# Altium schematic sheet Power_test.SchDoc
size A4
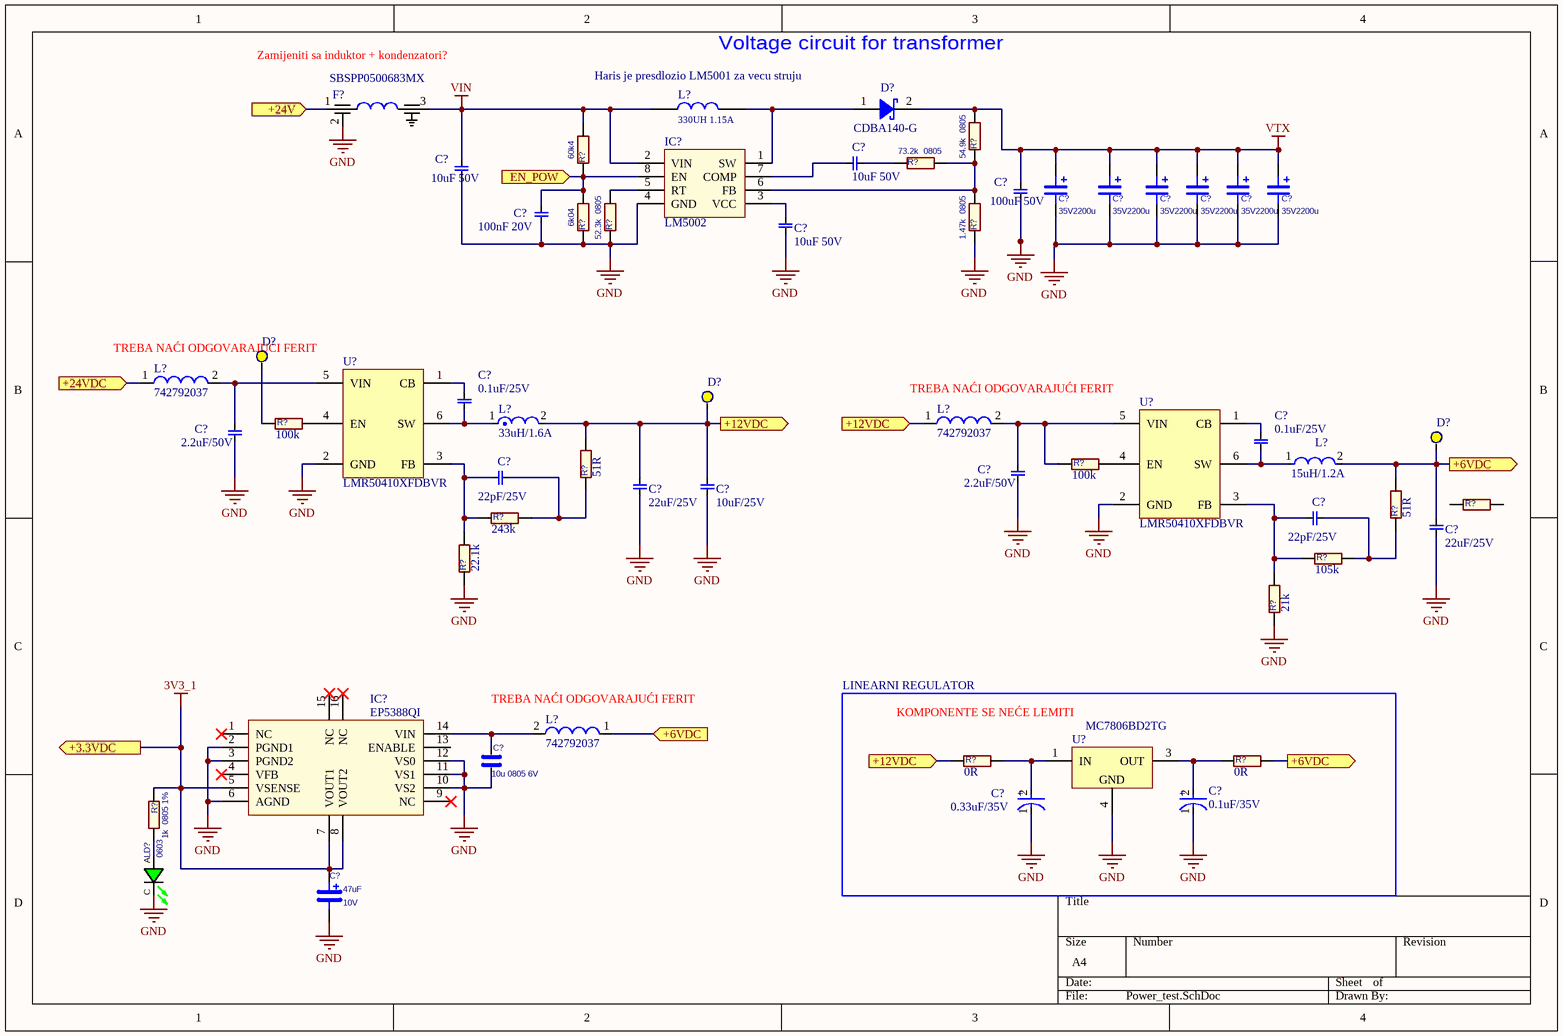
[diagram p0: Power_test.SchDoc]

## Parts
(Parts that share a designator on the sheet are numbered #1, #2 ... from top to bottom, then left to right.)
C?#1  10uF 50V  [C-0603]
C?#2  10uF 50V  [C-0805]
C?#3  35V2200u  [CAP_16X25]
C?#4  35V2200u  [CAP_16X25]
C?#5  35V2200u  [CAP_16X25]
C?#6  35V2200u  [CAP_16X25]
C?#7  35V2200u  [CAP_16X25]
C?#8  35V2200u  [CAP_16X25]
C?#9  100uF 50V  [C-0805]
C?#10  100nF 20V  [C-0603]
C?#11  10uF 50V  [C-0603]
C?#12  0.1uF/25V  [C-0603]
C?#13  2.2uF/50V  [FP-CL31-IPC_B]
C?#14  0.1uF/25V  [C-0603]
C?#15  2.2uF/50V  [FP-CL31-IPC_B]
C?#16  22pF/25V  [C-0603]
C?#17  10uF/25V  [C-1206 (3216 metric)]
C?#18  22uF/25V  [CAP-1210]
C?#19  22pF/25V  [C-0603]
C?#20  22uF/25V  [CAP-1210]
C?#21  10u 0805 6V  [CAP-0805]
C?#22  0.33uF/35V  [FP-UUP1H0R1MCL1GS-MFG]
C?#23  0.1uF/35V  [FP-UUP1H0R1MCL1GS-MFG]
C?#24  Capacitance: 47uF  Voltage Rating: 10V  [ECS_6.3]  (hidden comment: CAP 47uF 10V Radial Elec)
D?#1  Manufacturer Part Number 1: CDBA140-G  [DFN380P520X45-2N]  (hidden comment: DIODE SCHOTTKY 40V 1A DO214AC)
D?#2  Test_Point  [Test_Point]  (value not drawn)
D?#3  Test_Point  [Test_Point]  (value not drawn)
D?#4  Test_Point  [Test_Point]  (value not drawn)
F?  SBSPP0500683MX  [Filter_SBSPP0500]
IC?#1  LM5002  [SOIC127P600X205-8N]
IC?#2  EP5388QI  [PQFN50P320X320X100_HS-17N]
L?#1  330UH 1.15A  [IND]
L?#2  742792037  [SMD-0805]
L?#3  742792037  [SMD-0805]
L?#4  33uH/1.6A  [FP-DS104C2-MFG]
L?#5  15uH/1.2A  [FP-LQH5BPB_T0-MFG]
L?#6  742792037  [SMD-0805]
LD?  0603  [LED 0603 Green]
R?#1  73.2k  0805  [R-0603]
R?#2  54.9k  0805  [R-0603]
R?#3  60k4  [R-0603]
R?#4  6k04  [R-0603]
R?#5  52.3k  0805  [R-0603]
R?#6  1.47k  0805  [R-0603]
R?#7  100k  [R-0603]
R?#8  100k  [R-0603]
R?#9  51R  [R-0603]
R?#10  0R  [RES-0805]  (value not drawn)
R?#11  243k  [R-0603]
R?#12  51R  [R-0603]
R?#13  105k  [R-0603]
R?#14  22.1k  [R-0603]
R?#15  21k  [R-0603]
R?#16  0R  [RES-0805]
R?#17  0R  [RES-0805]
R?#18  1k  0805 1%  [RES-0805]
U?#1  LMR50410XFDBVR  [SOT-23]
U?#2  LMR50410XFDBVR  [SOT-23]
U?#3  MC7806BD2TG  [D2PAK]

## Ports
+3.3VDC (out), +6VDC (in), +6VDC (out), +12VDC (in), +12VDC (out), +24V (in), +24VDC (in), EN_POW (in)

## Nets
3V3_1: C?#24.1 IC?#2.5(VSENSE) IC?#2.7(VOUT1) IC?#2.8(VOUT2) R?#18.1 ; port +3.3VDC
GND: C?#2.2(G) C?#3.2 C?#4.2 C?#5.2 C?#6.2 C?#7.2 C?#8.2 C?#9.2(G) C?#10.1(G) C?#11.2(G) C?#13.1(G) C?#15.1(G) C?#17.2(G) C?#18.1(G) C?#20.1(G) C?#21.2 C?#22.1(C) C?#23.1(C) C?#24.2 F?.2 IC?#1.4(GND) IC?#2.2(PGND1) IC?#2.3(PGND2) IC?#2.6(AGND) IC?#2.10(VS2) IC?#2.11(VS1) IC?#2.12(VS0) LD?.C(CATHODE) R?#4.1 R?#5.1 R?#6.1 R?#14.1 R?#15.1 U?#1.2(GND) U?#2.2(GND) U?#3.4(GND)
VIN: C?#2.1(G) F?.3 IC?#1.2(VIN) L?#1.1(A) R?#3.2
VTX: C?#3.1 C?#4.1 C?#5.1 C?#6.1 C?#7.1 C?#8.1 C?#9.1(G) D?#1.2(A) R?#2.2
+6VDC: C?#20.2(G) D?#4.1 L?#5.2 L?#6.1 R?#12.2 R?#17.2 ; port +6VDC
+12VDC: C?#17.1(G) C?#18.2(G) D?#3.1 L?#3.1 L?#4.2 R?#9.2 R?#16.1 ; port +12VDC
+24V: F?.1 ; port +24V
+24VDC: L?#2.1 ; port +24VDC
EN_POW: C?#10.2(G) IC?#1.8(EN) R?#3.1 R?#4.2 ; port EN_POW
NetC?#1_1: C?#1.1(G) IC?#1.7(COMP)
NetC?#1_2: C?#1.2(G) R?#1.1
NetC?#11_1: C?#11.1(G) IC?#1.3(VCC)
NetC?#12_1: C?#12.1(G) L?#4.1 U?#1.6(SW)
NetC?#12_2: C?#12.2(G) U?#1.1(CB)
NetC?#13_2: C?#13.2(G) L?#2.2 U?#1.5(VIN)
NetC?#14_1: C?#14.1(G) L?#5.1 U?#2.6(SW)
NetC?#14_2: C?#14.2(G) U?#2.1(CB)
NetC?#15_2: C?#15.2(G) L?#3.2 R?#8.1 U?#2.5(VIN)
NetC?#16_1: C?#16.1(G) R?#11.1 R?#14.2 U?#1.3(FB)
NetC?#16_2: C?#16.2(G) R?#9.1 R?#11.2
NetC?#19_1: C?#19.1(G) R?#13.1 R?#15.2 U?#2.3(FB)
NetC?#19_2: C?#19.2(G) R?#12.1 R?#13.2
NetC?#21_1: C?#21.1 IC?#2.14(VIN) L?#6.2
NetC?#22_2: C?#22.2(A) R?#16.2 U?#3.1(IN)
NetC?#23_2: C?#23.2(A) R?#17.1 U?#3.3(OUT)
NetD?#1_1: D?#1.1(A) IC?#1.1(SW) L?#1.2(A)
NetD?#2_1: D?#2.1 R?#7.1
NetIC?#1_5: IC?#1.5(RT) R?#5.2
NetIC?#1_6: IC?#1.6(FB) R?#1.2 R?#2.1 R?#6.2
NetLD?_A: LD?.A(ANODE) R?#18.2
NetR?#7_2: R?#7.2 U?#1.4(EN)
NetR?#8_2: R?#8.2 U?#2.4(EN)

Not connected (* = marked no-connect by the designer): IC?#2 1(NC)* 4(VFB)* 9(NC)* 13(ENABLE) 15(NC)* 16(NC)*; R?#10 1 2

## Notes on the sheet
- (near F?) Zamijeniti sa induktor + kondenzatori?
- (near L?#1) Haris je presdlozio LM5001 za vecu struju
- Voltage circuit for transformer
- (near D?#2) TREBA NAĆI ODGOVARAJUĆI FERIT
- (near L?#3) TREBA NAĆI ODGOVARAJUĆI FERIT
- (near L?#6) TREBA NAĆI ODGOVARAJUĆI FERIT
- LINEARNI REGULATOR
- KOMPONENTE SE NEĆE LEMITI
- (in symbol UUP1H0R1MCL1GS) +
- (in symbol UZS1HR33MCL1GB) +

## Library data of the parts
C?#1 C?#2 C?#9 C?#11 = C-0805_10uF: Manufacturer 1: Yageo; Manufacturer Part Number 1: CC1206KKX7RBBB332; Tolerance: ±10%; Voltage - Rated: 500V; Temperature Coefficient: X7R; Notification: Current market demand for these product types have resulted in fluctuating and extending lead times. Lead times may differ.; Description 1: CAP CER 3300PF 500V X7R 1206; Category 1: Capacitors; Packaging: Cut Tape (CT); Part Status: Active; Operating Temperature: -55°C ~ 125°C; Features: -; Ratings: -; Applications: General Purpose; Failure Rate: -; Mounting Type: Surface Mount, MLCC; Package / Case: 1206 (3216 Metric); Size / Dimension: 0.126" L x 0.063" W (3.20mm x 1.60mm); Height - Seated (Max): -; Thickness (Max): 0.057" (1.45mm); Lead Spacing: -; Lead Style: -; ComponentLink1URL: http://www.yageo.com/documents/recent/UPY-NP0X7R_MV_100-to-630V_21.pdf; ComponentLink1Description: http://www.yageo.com/documents/recent/UPY-NP0X7R_MV_100-to-630V_21.pdf; Supplier 1: Digi-Key; Supplier Part Number 1: 311-1506-1-ND; RoHS 1: RoHS Compliant; Stock 1: 4928; Pricing 1: 1=0.31, 10=0.214, 100=0.1085, 500=0.07424, 1000=0.06568 (USD)
C?#3-C?#8 = CAP_2200uF_35V: Capacitor; Manufacturer: Kemet; Manufacturer Part Number: ESH228M035AM7AA; Capacitance: 2200µF; Tolerance: ±20%; Voltage Rating: 35V; Lifetime @ Temp.: 2000 Hrs @ 105°C; Supplier 1: Digi-Key; Supplier Part Number 1: 399-6572-ND; RoHS: RoHS Compliant; Category: Capacitors; Stock 1: 1972; Pricing 1: 1=0.98, 10=0.77, 50=0.6676, 100=0.5778, 250=0.5136, 500=0.43656, 1000=0.3852, 2500=0.35952, 5000=0.34668 (USD); Packaging: Bulk; ESR (Equivalent Series Resistance): -; Operating Temperature: -40°C ~ 105°C; Type: -; Applications: General Purpose; Ripple Current: -; Impedance: -; Lead Spacing: 0.295" (7.50mm); Size / Dimension: 0.630" Dia (16.00mm); Height - Seated (Max): 1.063" (27.00mm); Surface Mount Land Size: -; Mounting Type: Through Hole; Package / Case: Radial, Can; ComponentLink1URL: http://www.kemet.com/docfinder?Partnumber=ESH228M035AM7AA; ComponentLink1Description: http://www.kemet.com/docfinder?Partnumber=ESH228M035AM7AA
C?#10 = C-0805_100nF: Manufacturer 1: Yageo; Manufacturer Part Number 1: CC1206KKX7RBBB332; Tolerance: ±10%; Voltage - Rated: 500V; Temperature Coefficient: X7R; Notification: Current market demand for these product types have resulted in fluctuating and extending lead times. Lead times may differ.; Description 1: CAP CER 3300PF 500V X7R 1206; Category 1: Capacitors; Packaging: Cut Tape (CT); Part Status: Active; Operating Temperature: -55°C ~ 125°C; Features: -; Ratings: -; Applications: General Purpose; Failure Rate: -; Mounting Type: Surface Mount, MLCC; Package / Case: 1206 (3216 Metric); Size / Dimension: 0.126" L x 0.063" W (3.20mm x 1.60mm); Height - Seated (Max): -; Thickness (Max): 0.057" (1.45mm); Lead Spacing: -; Lead Style: -; ComponentLink1URL: http://www.yageo.com/documents/recent/UPY-NP0X7R_MV_100-to-630V_21.pdf; ComponentLink1Description: http://www.yageo.com/documents/recent/UPY-NP0X7R_MV_100-to-630V_21.pdf; Supplier 1: Digi-Key; Supplier Part Number 1: 311-1506-1-ND; RoHS 1: RoHS Compliant; Stock 1: 4928; Pricing 1: 1=0.31, 10=0.214, 100=0.1085, 500=0.07424, 1000=0.06568 (USD)
C?#12 C?#14 = 06033C104JAZ2A: 0.1µF ±5% 25V Ceramic Capacitor X7R 0603 (1608 Metric); Manufacturer: Kyocera AVX; Capacitance: 100nF; ComponentLink1URL: http://catalogs.avx.com/SurfaceMount.pdf?src-supplier=Digi-Key; ComponentLink1Description: http://catalogs.avx.com/SurfaceMount.pdf?src-supplier=Digi-Key; Case/Package: 0603; Category: Ceramic Capacitors; Dielectric: X7R; Features: Soft Termination; Length: 0.063inch; Manufacturer Part Number: 06033C104JAZ2A; Max Operating Temperature: 125°C; Min Operating Temperature: -55°C; Mount: Surface Mount; Package Quantity: 4000; Packaging: Tape and Reel; RoHS Compliant: Yes; Thickness: 0.035inch; Tolerance: 5%; Voltage Rating: 25V; Voltage Rating (DC): 25V; Width: 0.031inch
C?#13 C?#15 = CL31B225KBHVPNE: Cap Ceramic 2.2uF 50V X7R ±10% SMD 1206 +125°C Embossed T/R; Width: 0.063inch; Case/Package: 1206; Tolerance: 10%; Mount: Surface Mount; Capacitance: 2.2uF; Ratings: AEC-Q200; Thickness: 0.071inch; Voltage Rating: 50V; Features: Soft Termination; Case Code (Metric): 3216; Length: 0.126inch; Packaging: Tape and Reel; Max Operating Temperature: 125°C; Min Operating Temperature: -55°C; Case Code (Imperial): 1206; Dielectric: X7R
C?#16 C?#19 = C0603C220K3GACTU: 22pF ±10% 25V Ceramic Capacitor C0G, NP0 0603 (1608 Metric); Manufacturer: KEMET; Dissipation Factor: 0.1%; Width: 0.031inch; Capacitance: 22pF; Case Code (Imperial): 0603; Case Code (Metric): 1608; Case/Package: 0603; Category: Ceramic Capacitors; Construction: Flat; Contact Plating: Tin,Matte; Depth: 0.8mm; Dielectric: C0G; Dielectric Material: Ceramic; Height: 0.8mm; Lead Free: Lead Free; Lead Pitch: 0.7mm; Length: 1.6mm; Manufacturer Part Number: C0603C220K3GACTU; Max Operating Temperature: 125°C; Min Operating Temperature: -55°C; Mount: Surface Mount; Package Quantity: 4000; Packaging: Tape and Reel; Radiation Hardening: No; RoHS Compliant: Yes; Series: C; Termination: SMD/SMT; Thickness: 0.034inch; Tolerance: 10%; Voltage Rating: 25V; Voltage Rating (DC): 25V; ComponentLink1URL: https://datasheet.ciiva.com/5413/kem-c1003-c0g-smd-356956-5413159.pdf?src-supplier=Mouser; ComponentLink1Description: https://datasheet.ciiva.com/5413/kem-c1003-c0g-smd-356956-5413159.pdf?src-supplier=Mouser
C?#17 = CL31B106KAHNNNE: 10µF ±10% 25V Ceramic Capacitor X7R 1206 (3216 Metric); Manufacturer: Samsung; Capacitance: 10uF; Case Code (Imperial): 1206; Case Code (Metric): 3216; Case/Package: 1206; Category: Ceramic Capacitors; Construction: Flat; Depth: 1.6mm; Dielectric: X7R; Height: 1.6mm; Length: 3.2mm; Manufacturer Part Number: CL31B106KAHNNNE; Max Operating Temperature: 125°C; Min Operating Temperature: -55°C; Mount: Surface Mount; Package Quantity: 1; Packaging: Tape and Reel; Radiation Hardening: No; RoHS Compliant: Yes; Series: CL; Thickness: 0.071inch; Tolerance: 10%; Voltage: 25V; Voltage Rating: 25V; Width: 0.063inch; ComponentLink1URL: https://datasheet.ciiva.com/25795/cl31b106kahnnne-25795260.pdf?src-supplier=Digi-Key; ComponentLink1Description: https://datasheet.ciiva.com/25795/cl31b106kahnnne-25795260.pdf?src-supplier=Digi-Key
C?#18 C?#20 = CL32B226KAJNNNE: 22µF ±10% 25V Ceramic Capacitor X7R 1210 (3225 Metric); Manufacturer: Samsung; Capacitance: 22uF; Case Code (Imperial): 1210; Case Code (Metric): 3225; Case/Package: 1210; Category: Ceramic Capacitors; Construction: Flat; Depth: 2.5mm; Dielectric: X7R; Height: 2.5mm; Lead Free: Lead Free; Length: 3.2mm; Manufacturer Part Number: CL32B226KAJNNNE; Material: Ceramic; Max Operating Temperature: 125°C; Min Operating Temperature: -55°C; Mount: Surface Mount; Package Quantity: 1; Packaging: Tape and Reel; Radiation Hardening: No; RoHS Compliant: Yes; Series: CL; Thickness: 0.106inch; Tolerance: 10%; Voltage Rating: 25V; Voltage Rating (DC): 25V; Width: 0.098inch
C?#21 = 08056C106KAT2A: CAP CER 10UF 6.3V 10% X7R 0805; Manufacturer 1: AVX Corporation; Category 1: Capacitors; Tolerance: ?0%; Description 2: Multilayer Ceramic Capacitors MLCC - SMD/SMT 6.3volts 10uF 10% X7R; Category 2: Multilayer Ceramic Capacitors MLCC - SMD/SMT; Description 3: Cap Ceramic 10uF 6.3V X7R 10% SMD 0805 125C Embossed T/R; Lead Time: 16 weeks; Peak Solder Temperature: 260 deg C; MSL (Moisture Sensitivity Level): 1; Description 4: Capacitor; Ceramic; Cap 10uF Tol 10%; SMT; Vol-Rtg 6.3V; X7R; TR; Material, Element: Ceramic; Voltage, Rating: 6.3; Supplier 1: Digi-Key; Supplier Part Number 1: 478-5322-2-ND; Manufacturer Part Number 1: 08056C106KAT2A; RoHS 1: RoHS Compliant; Description 1: CAP CER 10UF 6.3V 10% X7R 0805; Temperature Coefficient: X7R; Mounting Type: Surface Mount, MLCC; Operating Temperature: -55°C ~ 125°C; Applications: General Purpose; Ratings: -; Package / Case: 0805 (2012 Metric); Size / Dimension: 0.079" L x 0.049" W (2.01mm x 1.25mm); Height - Seated (Max): -; Thickness (Max): 0.055" (1.40mm); Lead Spacing: -; Features: -; Packaging: Tape & Reel (TR); Lead Style: -; ComponentLink1URL: http://www.avx.com/docs/Catalogs/cx7r.pdf; ComponentLink1Description: http://www.avx.com/docs/Catalogs/cx7r.pdf; Supplier 2: Mouser; Supplier Part Number 2: 581-08056C106KAT2A; Manufacturer 2: AVX; Manufacturer Part Number 2: 08056C106KAT2A; RoHS 2: RoHS Compliant By Exemption; Dimensions: 1.25 mm W x 2.01 mm L x 1.52 mm H; Operating Temperature Range: - 55 C to + 125 C; Product: General Type MLCCs; Termination Style: SMD/SMT; Voltage Rating: 6.3 V; Case Code - in: 0805; Case Code - mm: 2012; Product Category: 0805 SMD Ceramic Capacitors; Standard Pack Qty: 3000; Temperature Coefficient / Code: X7R; RoHS - Mouser: E; Minimum Order Quantity: 1; Reeling: True; ComponentLink2URL: http://avx.com/docs/Catalogs/cx7r.pdf; ComponentLink2Description: http://avx.com/docs/Catalogs/cx7r.pdf; Supplier 3: Arrow; Supplier Part Number 3: 43503547S9668841N7710; Manufacturer 3: AVX; Manufacturer Part Number 3: 08056C106KAT2A; RoHS 3: CHINA ROHS: Compliant / EU ROHS: Compliant; Package Quantity: 3000; Termination Finish: Matte Sn/Ni; China ROHS Lead (X -> above / O -> below threshold): O; China ROHS Mercury (X -> above / O -> below threshold): O; China ROHS Cadmium (X -> above / O -> below threshold): O; China ROHS Hex Chromium (X -> above / O -> below threshold): O; China ROHS PBB (X -> above / O -> below threshold): O; China ROHS PBDE (X -> above / O -> below threshold): O; EU_ROHS_PROD_EXEMPTION_BY_SUPP: N/R; ComponentLink3URL: http://components.arrow.com/partservice/dataview/altium/43503547S9668841N7710?apiKey=aa438727d59eed98c4bed826d8d949c84cb5e685b92bf87346a0226bd2658797; ComponentLink3Description: http://components.arrow.com/partservice/dataview/altium/43503547S9668841N7710?apiKey=aa438727d59eed98c4bed826d8d949c84cb5e685b92bf87346a0226bd2658797; Supplier 4: Allied; Supplier Part Number 4: 70001700; Manufacturer 4: AVX; Manufacturer Part Number 4: 08056C106KAT2A; RoHS 4: RoHS Compliant; Category 4: Capacitors; Case Size: 0805; Dielectric Characteristic: X7R; Termination: SMT; Order Multiple: 1; ComponentLink4URL: http://www.alliedelec.com//www.alliedelec.com/images/products/datasheets/bm/AVX/70001075.pdf; ComponentLink4Description: http://www.alliedelec.com//www.alliedelec.com/images/products/datasheets/bm/AVX/70001075.pdf
C?#22 = UZS1HR33MCL1GB: 0.33µF 50V Aluminum Electrolytic Capacitors Radial, Can - SMD  2000 Hrs @ 85°C; Manufacturer: Nichicon; Capacitance: 330nF; Leakage Current: 3uA; Life (Hours): 2000Hour; Ripple Current: 2.8mA; Tolerance: 20%; Voltage Rating (DC): 50V; Case/Package: Radial; Category: Aluminum Electrolytic Capacitors; Features: General Purpose; Height - Seated (Max): 0.157inch; Length: 4.5mm; Manufacturer Part Number: UZS1HR33MCL1GB; Max Operating Temperature: 85°C; Min Operating Temperature: -40°C; Mount: Surface Mount; Package Quantity: 2000; Packaging: Tape and Reel; RoHS Compliant: Yes; Series: ZS; Termination: SMD/SMT; Voltage Rating: 50V
C?#23 = UUP1H0R1MCL1GS: 0.1µF 50V Aluminum Electrolytic Capacitors Radial, Can - SMD  1000 Hrs @ 105°C; Life (Hours): 1000Hour; Leakage Current: 10uA; Ripple Current: 1mA; Tolerance: 20%; Dissipation Factor: 0.15%; Capacitance: 100nF; Radiation Hardening: No; Max Operating Temperature: 105°C; Voltage Rating: 50V; Package Quantity: 2000; Diameter: 4mm; Voltage Rating (DC): 50V; Mount: Surface Mount; Packaging: Tape and Reel; Termination: SMD/SMT; Min Operating Temperature: 1000°C; Length: 5.8mm; Height: 5.8mm; Case/Package: Radial; Height - Seated (Max): 0.157inch
C?#24 = 10SVP47M: SANYO - 10SVP47M - CAPACITOR, 47UF, 10V; Capacitance Tolerance: ?20%; Life Time @ Temperature: 2000 hours @ 105; ESR: 0.05; AC Ripple Current: 1620; Capacitor Mounting: SMD; External Depth: 6.6; External Length / Height: 5.9; Tolerance +: 20%; Voltage Rating V DC: 10; Description 2: OSCON CAP47UF,  10V; Category 2: Uncategorized; Order Multiple: 5; Description 3: SANYO - 10SVP47M - CAPACITOR POLYMER ALUM, 47UF, 10V, 20%, SMD; Description 4: SANYO - 20SVP47M - CAPACITOR, 47UF, 20V; Description 5: OSCON CAP47UF,  20V; Description 7: SANYO - 20SVP47M - CAPACITOR POLYMER ALUM, 47UF, 20V, 20%, SMD; Category 1: Capacitors; Supplier 1: Farnell; Supplier Part Number 1: 9188908; Manufacturer 1: SANYO; Manufacturer Part Number 1: 10SVP47M; RoHS 1: YES; Description 1: SANYO - 10SVP47M - CAPACITOR, 47UF, 10V; Stock 1: 538; Pricing 1: 1=35,59, 50=31,14, 100=27,54, 1000=24,86 (EUR); Height: 5.9; Diameter: 6.3; Operating Temperature Range: -55°C to +105; External Width: 6.6; Package / Case: C6; Series: SVP; Termination Type: SMD; Tolerance -: 20%; ComponentLink1URL: http://www.farnell.com/datasheets/31865.pdf; ComponentLink1Description: http://www.farnell.com/datasheets/31865.pdf; Supplier 2: Allied; Supplier Part Number 2: R1017931; Manufacturer 2: Sanyo Energy; Manufacturer Part Number 2: 10SVP47M; RoHS 2: No; Stock 2: 0; Pricing 2: 5=$3.65 (USD); Minimum Order Quantity: 5; Package Quantity: EA; ComponentLink2URL: http://www.alliedelec.com//docs-usa.electrocomponents.com/techlib:/itc_doclist_US.htm?stockno=6516006; ComponentLink2Description: http://www.alliedelec.com//docs-usa.electrocomponents.com/techlib:/itc_doclist_US.htm?stockno=6516006; Supplier 3: Newark; Supplier Part Number 3: 98K5231; Manufacturer 3: SANYO; Manufacturer Part Number 3: 10SVP47M; RoHS 3: YES; Stock 3: 1732; Pricing 3: 1=2,17, 100=1,94, 250=1,78, 500=1,64, 1000=1,51 (USD); Capacitor Terminals: SMD; Supplier 4: Farnell; Supplier Part Number 4: 9189130; Manufacturer 4: SANYO; Manufacturer Part Number 4: 20SVP47M; RoHS 4: YES; Stock 4: 1226; Pricing 4: 1=30,96, 50=27,25, 100=24,06, 1000=22,19 (EUR); Supplier 5: Allied; Supplier Part Number 5: R1017932; Manufacturer 5: Sanyo Energy; Manufacturer Part Number 5: 20SVP47M; RoHS 5: No; Category 5: Uncategorized; Stock 5: 0; Pricing 5: 5=$4.14 (USD); ComponentLink3URL: http://www.alliedelec.com//docs-usa.electrocomponents.com/techlib:/itc_doclist_US.htm?stockno=6516012; ComponentLink3Description: http://www.alliedelec.com//docs-usa.electrocomponents.com/techlib:/itc_doclist_US.htm?stockno=6516012; Supplier 6: Farnell; Supplier Part Number 6: 9189130RL; Manufacturer 6: SANYO; Manufacturer Part Number 6: 20SVP47M; RoHS 6: YES; Description 6: SANYO - 20SVP47M - CAPACITOR, 47UF, 20V; Stock 6: 1226; Pricing 6: 1=30,96, 50=27,25, 100=24,06, 1000=22,19 (EUR); Supplier 7: Newark; Supplier Part Number 7: 60K7599; Manufacturer 7: SANYO; Manufacturer Part Number 7: 20SVP47M; RoHS 7: YES; Stock 7: 1994; Pricing 7: 1=2,07, 100=1,86, 250=1,7, 500=1,56, 1000=1,45 (USD)
D?#1 = DIODE SCHOTTKY 40V 1A DO214AC: Manufacturer 1: Comchip Technology; Category 1: Discrete Semiconductor Products; Speed: Fast Recovery =< 500ns, > 200mA (Io); Supplier 1: Digi-Key; Supplier Part Number 1: 641-1015-1-ND; RoHS 1: RoHS Compliant; Description 1: DIODE SCHOTTKY 40V 1A DO214AC; Stock 1: 527910; Pricing 1: 1=0.37, 10=0.338, 100=0.1893, 500=0.1014, 1000=0.06895 (USD); Packaging: Cut Tape (CT); Part Status: Active; Diode Type: Schottky; Current - Average Rectified (Io): 1A; Capacitance @ Vr, F: -; Mounting Type: Surface Mount; Package / Case: DO-214AC, SMA; Supplier Device Package: DO-214AC (SMA); Operating Temperature - Junction: -65°C ~ 125°C; Base Part Number: CDBA140; ComponentLink1URL: http://www.comchiptech.com/admin/files/product/CDBA140-HF%20Thru192841.%20CDBA1100-HF%20RevB.pdf; ComponentLink1Description: http://www.comchiptech.com/admin/files/product/CDBA140-HF%20Thru192841.%20CDBA1100-HF%20RevB.pdf
F? = Filter_SBSPP0500683MX
IC?#1 = LM5002: Manufacturer 1: Texas Instruments; Manufacturer Part Number 1: LM5002SD/NOPB; Description 1: IC REG MULT CONFIG ISO ADJ 8WSON; Category 1: Integrated Circuits (ICs); Function: Step-Up, Step-Up/Step-Down; Output Configuration: Positive, Isolation Capable; Topology: Boost, Flyback, Forward Converter, SEPIC; Output Type: Adjustable; Number of Outputs: 1; Voltage - Input (Min): 3.1V; Voltage - Input (Max): 75V; Voltage - Output (Max): 76V (Switch); Current - Output: 400mA (Switch); Frequency - Switching: 50kHz ~ 1.5MHz; Synchronous Rectifier: No; Supplier 1: Digi-Key; Supplier Part Number 1: LM5002SD/NOPBTR-ND; RoHS 1: RoHS Compliant; Stock 1: 3000; Pricing 1: 1000=1.9656, 2000=1.86732, 5000=1.79712 (USD); Packaging: Tape & Reel (TR); Part Status: Active; Voltage - Output (Min/Fixed): 3.1V; Operating Temperature: -40°C ~ 125°C (TJ); Mounting Type: Surface Mount; Package / Case: 8-WDFN Exposed Pad; Supplier Device Package: 8-WSON (4x4); ComponentLink1URL: http://www.ti.com/lit/ds/symlink/lm5002.pdf; ComponentLink1Description: http://www.ti.com/lit/ds/symlink/lm5002.pdf; Base Part Number: LM5002
IC?#2 = EP5388QI: Manufacturer: Intel; Supplier 1: Digi-Key; Supplier Part Number 1: 544-2875-6-ND; Manufacturer Part Number: EP5388QI
L?#1 = FIXED IND 330UH 1.15A 580 MOHM: Manufacturer 1: BOURNS; Manufacturer Part Number 1: SRR1260-331K; Description 1: BOURNS - SRR1260-331K - INDUCTOR, SHIELDED, 330UH, 1.1A, SMD; Inductance: 330; RMS Current (Irms): 1.15; Inductor Construction: Shielded; Saturation Current (Isat): 1.1; Product Range: SRR1260 Series; Power Inductor Case: 12.5mm x 12.5mm x 6; Q Factor: 22; Supplier 1: Farnell; Supplier Part Number 1: 2458509; RoHS 1: YES; Stock 1: 143; Pricing 1: 1=0.843, 10=0.721, 25=0.661, 50=0.6, 100=0.552 (GBP); ComponentLink1URL: http://www.farnell.com/datasheets/2251090.pdf; ComponentLink1Description: http://www.farnell.com/datasheets/2251090.pdf
L?#2 L?#3 L?#6 = 742792037: SMD EMI Suppression Ferrite Bead WE-CBF, Z = 330 Ohm; Impedance: 330 Ohm; PackageReference: SMD-0805; ComponentLink1URL: http://www.we-online.com; PackageVersion: 2005; ComponentLink2URL: http://www.we-online.de/katalog/media/pdf/742792037.pdf; ComponentLink1Description: Manufacturer Link; DatasheetVersion: Dec-2005; PackageDescription: Chip Inductor, 2-Leads, Body 2.0 x 1.2 mm; ComponentLink2Description: Datasheet
L?#4 = #B952AS-H-330M=P3: Shielded Wirewound Inductor 33uH 20% 1600mA 0.125Ω SMD; Current Rating: 1.6A; Saturation Current: 2A; DC Resistance (DCR): 125mR; Core Material: Ferrite; Test Frequency: 100kHz; Shielding: Shielded; Tolerance: 20%; Height - Seated (Max): 0.19inch; Mount: Surface Mount; Resistor Type: Wirewound; Inductance: 33uH; Packaging: Tape and Reel; Min Operating Temperature: -40°C; Length: 0.409inch; Width: 0.409inch; Case/Package: Nonstandard; Max Operating Temperature: 85°C
L?#5 = LQH5BPN150MT0L: 15µH Shielded Wirewound Inductor 1.2A 187mOhm Max Nonstandard; Core Material: Ferrite; Inductance: 15uH; Saturation Current: 1.6A; Test Frequency: 100kHz; Self Resonant Frequency: 18MHz; Tolerance: 20%; DC Resistance (DCR): 225mR; Max Operating Temperature: 85°C; Length: 0.197inch; Depth: 5.2mm; REACH SVHC: No SVHC; Package Quantity: 500; Packaging: Tape and Reel; Resistor Type: Wirewound; Inductance Tolerance: 20%; Military Standard: Not; DC Current: 1.2A; Min Operating Temperature: -40°C; Current Rating: 1.2A; Case Code (Metric): 5050; Height - Seated (Max): 0.086inch; Case/Package: 2020; Termination: SMD/SMT; Case Code (Imperial): 2020; Shielding: Shielded; Height: 2mm; Width: 5mm; Max DC Current: 1.6A; Mount: Surface Mount
LD? = LED_GRN_0603: 0603 GRN LED; Manufacturer 1: Osram Opto Semiconductor; Manufacturer Part Number 1: LG Q971-KN-1; Category 1: Standard LEDs - SMD; Description 1: Standard LEDs - SMD Green, 570nm 10mcd, 20mA; Illumination Colour: Green; Forward Current: 20 mA; Forward Voltage: 2.2 V; LED Size: 1.6 mm x 0.8 mm x 0.3 mm; Luminous Intensity: 10 mcd; Viewing Angle: 160 deg; Wavelength/Colour Temperature: 570 nm; Supplier 1: Mouser; Supplier Part Number 1: 720-LGQ971-KN-1; RoHS 1: RoHS Compliant; Package/Case: 0603; Packaging: Reel; Maximum Operating Temperature: + 85 C; Minimum Operating Temperature: - 40 C; Product Category: Standard LED - Surface Mount; Standard Pack Qty: 16000; RoHS - Mouser: Y; Minimum Order Quantity: 1; Reeling: True; ComponentLink1URL: http://catalog.osram-os.com/catalogue/catalogue.do;jsessionid=B82A462BB9500FF5EC02EA555C13E990?act=downloadFile&favOid=0200000600005069000100b6; ComponentLink1Description: http://catalog.osram-os.com/catalogue/catalogue.do;jsessionid=B82A462BB9500FF5EC02EA555C13E990?act=downloadFile&favOid=0200000600005069000100b6; Color: GRN
R?#1 R?#2 R?#5 R?#6 = CRCW0805xxxxJN Default: RES xx OHM 1/8W 5% 0805 SMD; Category 1: Resistors
R?#3 R?#4 = CRCW08051K00FKEA: RES 1 KOHM 1/8W 1% 0805 SMD; Manufacturer 1: Vishay Dale; Description 1: RES SMD 1K OHM 1% 1/8W 0805; Category 1: Resistors; Resistance (Ohms): 1k; Power (Watts): 0.125W, 1/8W; Temperature Coefficient: ±100ppm/°C; Description 2: Thick Film Resistors - SMD 1/8watt 1Kohms 1% 100ppm; Category 2: Thick Film Resistors - SMD; Power Rating: 125 mW (1/8 W); Resistance: 1 kOhms; Voltage Rating: 150 V; Brand: Vishay / Dale; Supplier 1: Digi-Key; Supplier Part Number 1: 541-1.00KCCT-ND; Manufacturer Part Number 1: CRCW08051K00FKEA; RoHS 1: RoHS Compliant; Packaging: Cut Tape (CT); Tolerance: ±1%; Composition: Thick Film; Features: Automotive AEC-Q200; Operating Temperature: -55°C ~ 155°C; Package / Case: 0805 (2012 Metric); Supplier Device Package: 0805 (2012 Metric); Size / Dimension: 0.079" L x 0.049" W (2.00mm x 1.25mm); Height: 0.020" (0.50mm); ComponentLink1URL: http://www.vishay.com/docs/20035/dcrcwe3.pdf; ComponentLink1Description: http://www.vishay.com/docs/20035/dcrcwe3.pdf; Supplier 2: Mouser; Supplier Part Number 2: 71-CRCW0805-1.0K-E3; Manufacturer 2: Vishay; Manufacturer Part Number 2: CRCW08051K00FKEA; RoHS 2: RoHS Compliant By Exemption; Length: 2 mm; Operating Temperature Range: - 55 C to + 155 C; Package/Case: 0805 (2012 metric); Product: Thick Film Resistors SMD; Series: CRCW; Termination Style: SMD/SMT; Width: 1.25 mm; Case Code - in: 0805; Case Code - mm: 2012; Product Category: 0805 Thick Film Chip Resistors; Standard Pack Qty: 5000; RoHS - Mouser: E; Minimum Order Quantity: 1; Reeling: True; ComponentLink2URL: http://www.mouser.com/ds/2/427/dcrcwe3-109170.pdf; ComponentLink2Description: http://www.mouser.com/ds/2/427/dcrcwe3-109170.pdf
R?#7 R?#8 = RR0816P-104-D: 100 kOhms ±0.5% 0.063W, 1/16W Chip Resistor 0603 (1608 Metric)  Thin Film; Manufacturer: Susumu; Working Voltage: 75V; Max Power Dissipation: 63mW; Resistance: 100kR; Temperature Coefficient: 25ppm/°C; ComponentLink1URL: https://datasheet.ciiva.com/2487/rr-data-sheet-2487067.pdf?src-supplier=Digi-Key; ComponentLink1Description: https://datasheet.ciiva.com/2487/rr-data-sheet-2487067.pdf?src-supplier=Digi-Key; Case Code (Imperial): 0603; Case Code (Metric): 1608; Case/Package: 0603; Category: Chip SMD Resistors; Depth: 0.8mm; Height: 0.4mm; Lead Free: Lead Free; Length: 1.6mm; Manufacturer Part Number: RR0816P-104-D; Max Operating Temperature: 125°C; Min Operating Temperature: -55°C; Number of Pins: 2; Number of Terminations: 2; Package Quantity: 1; Packaging: Tape and Reel; Power Rating: 63mW; REACH SVHC: Unknown; Resistance Tolerance: 0.5%; Resistor Type: Thin Film; RoHS Compliant: Yes; Series: RR; Technology: THIN FILM; Termination: SMD/SMT; Tolerance: 0.5%; Voltage Rating: 75V; Voltage Rating (DC): 75V; Width: 0.8mm
R?#9 R?#12 = RR0816Q-510-D: 51 Ohms ±0.5% 0.063W, 1/16W Chip Resistor 0603 (1608 Metric)  Thin Film; Manufacturer: Susumu; Max Power Dissipation: 63mW; Power Rating: 62.5mW; Temperature Coefficient: 50ppm/°C; Voltage Rating: 75V; ComponentLink1URL: https://datasheet.ciiva.com/2498/rr-data-sheet-2498074.pdf?src-supplier=Digi-Key; ComponentLink1Description: https://datasheet.ciiva.com/2498/rr-data-sheet-2498074.pdf?src-supplier=Digi-Key; Width: 0.8mm; Case Code (Imperial): 0603; Case Code (Metric): 1608; Case/Package: 0603; Category: Chip SMD Resistors; Depth: 0.8mm; Height: 0.4mm; Lead Free: Lead Free; Length: 1.6mm; Manufacturer Part Number: RR0816Q-510-D; Max Operating Temperature: 125°C; Min Operating Temperature: -55°C; Mount: Surface Mount; Number of Terminations: 2; Package Quantity: 1; Packaging: Tape and Reel; Resistance: 51R; Resistor Type: Thin Film; RoHS Compliant: Yes; Series: RR; Size Code: 0603; Technology: THIN FILM; Termination: SMD/SMT; Tolerance: 0.5%; Voltage Rating (DC): 75V; ComponentLink2URL: https://datasheet.ciiva.com/2498/rr-data-sheet-2498317.pdf?src-supplier=Digi-Key; ComponentLink2Description: https://datasheet.ciiva.com/2498/rr-data-sheet-2498317.pdf?src-supplier=Digi-Key
R?#10 R?#16 R?#17 = RC0805JR-070RL: 0 Ohms Jumper 0.125W, 1/8W Chip Resistor 0805 (2012 Metric) Moisture Resistant Thick Film
R?#11 = RR0816P-2433-D-38D: 243 kOhms ±0.5% 0.063W, 1/16W Chip Resistor 0603 (1608 Metric)  Thin Film; Manufacturer: Susumu; Max Power Dissipation: 63mW; Power Rating: 62.5mW; Resistance: 243kR; Temperature Coefficient: 25ppm/°C; Voltage Rating: 75V; Width: 0.8mm; Case Code (Imperial): 0603; Case Code (Metric): 1608; Case/Package: 0603; Category: Chip SMD Resistors; Height: 0.02inch; Lead Free: Lead Free; Length: 0.063inch; Manufacturer Part Number: RR0816P-2433-D-38D; Max Operating Temperature: 125°C; Min Operating Temperature: -55°C; Number of Terminations: 2; Package Quantity: 1; Packaging: Tape and Reel; Resistor Type: Thin Film; RoHS Compliant: Yes; Series: RR; Termination: SMD/SMT; Tolerance: 0.5%; Voltage Rating (DC): 75V; Weight: 7.1E-05oz; ComponentLink1URL: https://datasheet.ciiva.com/2498/rr-data-sheet-2498074.pdf?src-supplier=Digi-Key; ComponentLink1Description: https://datasheet.ciiva.com/2498/rr-data-sheet-2498074.pdf?src-supplier=Digi-Key
R?#13 = RN73C1J105KBTD: 105 kOhms ±0.1% 0.063W, 1/16W Chip Resistor 0603 (1608 Metric)  Thin Film; Manufacturer: TE Connectivity; Manufacturer Part Number: RN73C1J105KBTDF; Max Power Dissipation: 63mW; Number of Resistors: 1; Resistance: 105kR; Temperature Coefficient: 10ppm/°C; Voltage Rating: 50V; Case Code (Imperial): 0603; Case Code (Metric): 1608; Case/Package: 0603; Category: Chip SMD Resistors; ELV: Compliant; Height: 0.45mm; Length: 1.55mm; Max Operating Temperature: 155°C; Min Operating Temperature: -55°C; Mount: Surface Mount; Number of Terminations: 2; Package Quantity: 1000; Packaging: Tape and Reel; Power Rating: 63mW; Resistance Tolerance: 0.1%; Resistor Type: Thin Film; RoHS Compliant: Yes; Series: RN73, Holsworthy; Termination: Solder; Tolerance: 0.1%; Voltage Rating (DC): 50V; Width: 0.8mm; ComponentLink1URL: https://www.te.com/commerce/DocumentDelivery/DDEController?Action=srchrtrv&amp;DocNm=1773270&amp;DocType=DS&amp;DocLang=English&src-supplier=Digi-Key; ComponentLink1Description: https://www.te.com/commerce/DocumentDelivery/DDEController?Action=srchrtrv&amp;DocNm=1773270&amp;DocType=DS&amp;DocLang=English&src-supplier=Digi-Key
R?#14 = RR0816P-2212-D-34C: 22.1 kOhms ±0.5% 0.063W, 1/16W Chip Resistor 0603 (1608 Metric)  Thin Film; Manufacturer: Susumu; Max Power Dissipation: 63mW; Power Rating: 62.5mW; Resistance: 22.1kR; Temperature Coefficient: 25ppm/°C; Voltage Rating: 75V; Case Code (Imperial): 0603; Case Code (Metric): 1608; Case/Package: 0603; Category: Chip SMD Resistors; Height: 0.02inch; Height - Seated (Max): 0.02inch; Lead Free: Lead Free; Length: 0.063inch; Manufacturer Part Number: RR0816P-2212-D-34C; Max Operating Temperature: 125°C; Min Operating Temperature: -55°C; Number of Terminations: 2; Package Quantity: 1; Packaging: Tape and Reel; Resistor Type: Thin Film; RoHS Compliant: Yes; Series: RR; Size Code: 0603; Termination: SMD/SMT; Tolerance: 0.5%; Voltage Rating (DC): 75V; Width: 0.032inch; ComponentLink1URL: https://datasheet.ciiva.com/2497/rr-data-sheet-2497842.pdf?src-supplier=Digi-Key; ComponentLink1Description: https://datasheet.ciiva.com/2497/rr-data-sheet-2497842.pdf?src-supplier=Digi-Key
R?#15 = RR0816P-2102-D-32C: 21 kOhms ±0.5% 0.063W, 1/16W Chip Resistor 0603 (1608 Metric)  Thin Film; Manufacturer: Susumu; Max Power Dissipation: 63mW; Power Rating: 62.5mW; Resistance: 21kR; Temperature Coefficient: 25ppm/°C; Voltage Rating: 75V; Case Code (Imperial): 0603; Case Code (Metric): 1608; Case/Package: 0603; Category: Chip SMD Resistors; Height: 0.02inch; Lead Free: Lead Free; Length: 0.063inch; Manufacturer Part Number: RR0816P-2102-D-32C; Max Operating Temperature: 125°C; Min Operating Temperature: -55°C; Number of Terminations: 2; Package Quantity: 1; Packaging: Tape and Reel; Resistor Type: Thin Film; RoHS Compliant: Yes; Series: RR; Size Code: 0603; Termination: SMD/SMT; Tolerance: 0.5%; Voltage Rating (DC): 75V; Width: 0.8mm; ComponentLink1URL: https://datasheet.ciiva.com/2487/rr-data-sheet-2487553.pdf?src-supplier=Digi-Key; ComponentLink1Description: https://datasheet.ciiva.com/2487/rr-data-sheet-2487553.pdf?src-supplier=Digi-Key
R?#18 = CRCW08051K00FKEA: RES 1 KOHM 1/8W 1% 0805 SMD; Manufacturer 1: Vishay Dale; Description 1: RES SMD 1K OHM 1% 1/8W 0805; Category 1: Resistors; Power (Watts): 0.125W, 1/8W; Temperature Coefficient: ±100ppm/°C; Description 2: Thick Film Resistors - SMD 1/8watt 1Kohms 1% 100ppm; Category 2: Thick Film Resistors - SMD; Power Rating: 125 mW (1/8 W); Resistance: 1 kOhms; Voltage Rating: 150 V; Brand: Vishay / Dale; Supplier 1: Digi-Key; Supplier Part Number 1: 541-1.00KCCT-ND; Manufacturer Part Number 1: CRCW08051K00FKEA; RoHS 1: RoHS Compliant; Packaging: Cut Tape (CT); Resistance (Ohms): 1k; Tolerance: ±1%; Composition: Thick Film; Features: Automotive AEC-Q200; Operating Temperature: -55°C ~ 155°C; Package / Case: 0805 (2012 Metric); Supplier Device Package: 0805 (2012 Metric); Size / Dimension: 0.079" L x 0.049" W (2.00mm x 1.25mm); Height: 0.020" (0.50mm); ComponentLink1URL: http://www.vishay.com/docs/20035/dcrcwe3.pdf; ComponentLink1Description: http://www.vishay.com/docs/20035/dcrcwe3.pdf; Supplier 2: Mouser; Supplier Part Number 2: 71-CRCW0805-1.0K-E3; Manufacturer 2: Vishay; Manufacturer Part Number 2: CRCW08051K00FKEA; RoHS 2: RoHS Compliant By Exemption; Length: 2 mm; Operating Temperature Range: - 55 C to + 155 C; Package/Case: 0805 (2012 metric); Product: Thick Film Resistors SMD; Series: CRCW; Termination Style: SMD/SMT; Width: 1.25 mm; Case Code - in: 0805; Case Code - mm: 2012; Product Category: 0805 Thick Film Chip Resistors; Standard Pack Qty: 5000; RoHS - Mouser: E; Minimum Order Quantity: 1; Reeling: True; ComponentLink2URL: http://www.mouser.com/ds/2/427/dcrcwe3-109170.pdf; ComponentLink2Description: http://www.mouser.com/ds/2/427/dcrcwe3-109170.pdf
U?#1 U?#2 = LMR50410XFDBVR: Buck Switching Regulator IC Positive Adjustable 1V 1 Output 1A SOT-23-6; Manufacturer: Texas Instruments; Manufacturer Part Number: LMR50410XFDBVR
U?#3 = MC7806BD2TG: IC REG LINEAR 6V 1A D2PAK; Manufacturer: ON Semiconductor; Accuracy: 4%; Dropout Voltage: 2V; Max Input Voltage: 35V; Number of Outputs: 1; Output Type: Fixed; Polarity: Positive; Quiescent Current: 8mA; Case/Package: D2PAK; Category: Voltage Regulators - Linear; Contact Plating: Tin,Matte; Halogen Free: Halogen Free; Height: 4.572mm; Lead Free: Lead Free; Length: 10.24mm; Manufacturer Part Number: MC7806BD2TG; Max Operating Temperature: 125°C; Max Output Current: 1A; Min Input Voltage: 35V; Min Operating Temperature: -40°C; Min Output Voltage: 6V; Mount: Surface Mount; Number of Pins: 3; Number of Regulators: 1; Output Current: 1A; Output Voltage: 6V; Output Voltage Accuracy: 4%; Package Quantity: 50; Packaging: Rail/Tube; Radiation Hardening: No; RoHS Compliant: Yes; Series: -; Width: 9.347mm; ComponentLink1URL: https://datasheet.ciiva.com/6581/mc7800-d-6581174.pdf?src-supplier=Digi-Key; ComponentLink1Description: https://datasheet.ciiva.com/6581/mc7800-d-6581174.pdf?src-supplier=Digi-Key